# Altium schematic sheet Sheet1.SchDoc: TITRE
size Letter; ApprovedBy: APPROUVÉ PAR; Organization: Cegep Limoilou; Address1: 1300, 8e Avenue; Address2: Québec, QC; Address3: Canada; Address4: G1J 5L5; SheetNumber: 1; SheetTotal: 1
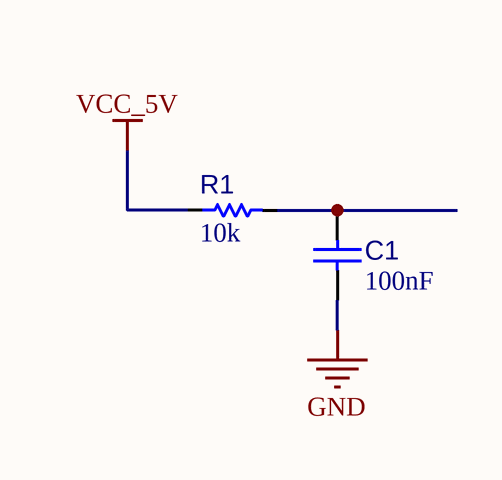
[diagram p0: Sheet1.SchDoc]

## Parts
C1  value 100nF  [C_1608[0603]]  (hidden comment: Cap 100nF 0603)
R1  value 10k  [R_1608[0603]]  (hidden comment: Res 10k 1% 0603)

## Nets
GND: C1.1
VCC_5V: R1.1
NetC1_2: C1.2 R1.2

## Notes on the sheet
- Titre :
- Conception :
- Date :
- Approbation :
- Heure :
- Révision :
- Feuille
- de
- Fichier :

## Library data of the parts
C1 = CAP002: Capacitor type 1; Manufacturer 1: Yageo; Manufacturer Part Number 1: CC0603KRX7R9BB104; LibRef: CAP002; CEGEP: COND0143SM; Tolerance: 10%; Rated Voltage: 50V; Dielectric: X7R; Mount: SMT; Supplier 1: LCSC; Supplier Part Number 1: C14663
R1 = RES001: Resistor type 1; Manufacturer 1: Yageo; Manufacturer Part Number 1: RC0603FR-0710KL; LibRef: RES001; CEGEP: RESI0238-0603; Puissance: 1/10W; Max Working Voltage: 75V; Tolerance: 1%; Mount: SMT; Supplier 1: LCSC; Supplier Part Number 1: C98220